# Altium project senior_design_v3.PrjPCB
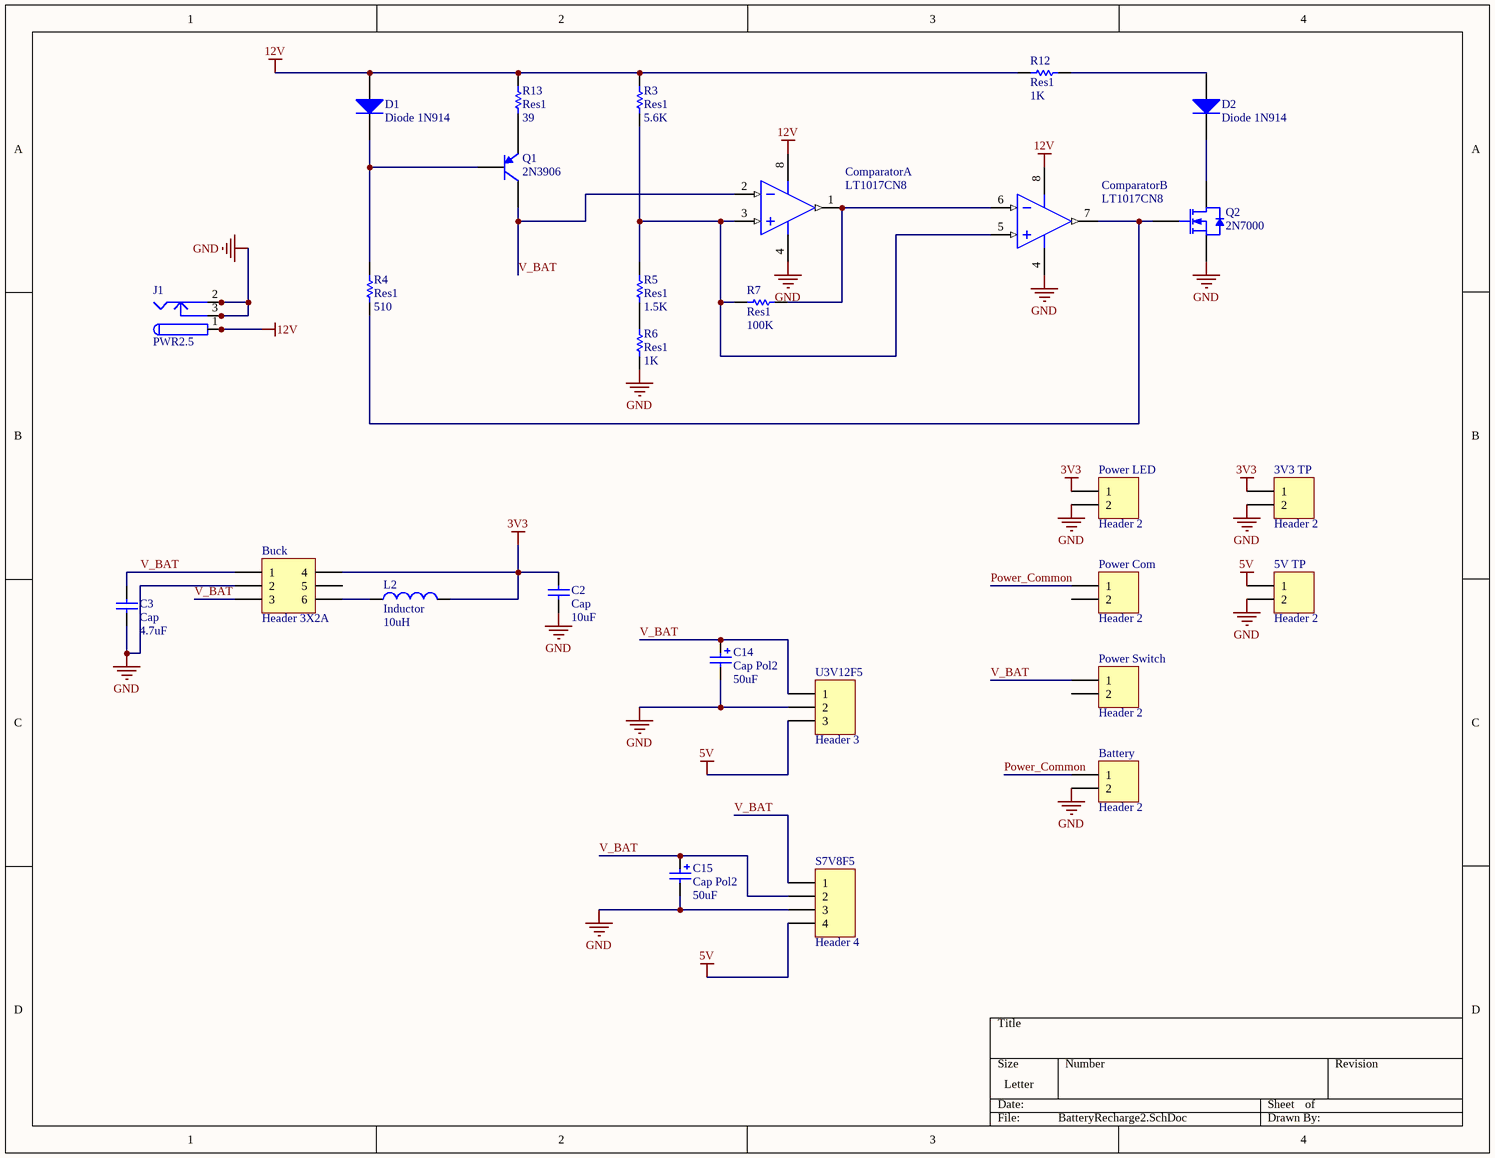
[diagram p0: BatteryRecharge2.SchDoc]
5 sheets, 81 parts. Net scope: global (net labels, ports and power ports of the same name join across sheets).
Board file: main_pcb_v0.PcbDoc
Sheets:
  BatteryRecharge2.SchDoc
  dac_audio_out.SchDoc
  fpga_sram.SchDoc
  lcd_breakout.SchDoc
  MSPBreakout.SchDoc

## Sheet BatteryRecharge2.SchDoc
size Letter

### Parts
(Parts that share a designator on the sheet are numbered #1, #2 ... from top to bottom, then left to right.)
3V3_TP  Header 2  [HDR1X2]
5V_TP  Header 2  [HDR1X2]
Battery  Header 2  [HDR1X2]
Buck  Header 3X2A  [SOT23-6_M]
C2#1  Cap  value 10uF  [6-0805_M]
C3#1  Cap  value 4.7uF  [6-0805_M]
C14  Cap Pol2  value 50uF  [AXIAL-0.3]
C15  Cap Pol2  value 50uF  [AXIAL-0.3]
Comparator  LT1017CN8  [LT-N8]  (parts A,B of 2)
D1  Diode 1N914  [DO-35]
D2  Diode 1N914  [DO-35]
J1  PWR2.5  [KLD-0202]
L2  Inductor  value 10uH  [AXIAL-0.3]
Power_Com  Header 2  [HDR1X2]
Power_LED  Header 2  [HDR1X2]
Power_Switch  Header 2  [HDR1X2]
Q1  2N3906  [TO-92A]
Q2  2N7000  [SOT54]
R3  Res1  value 5.6K  [6-0805_M]
R4  Res1  value 510  [6-0805_M]
R5  Res1  value 1.5K  [6-0805_M]
R6  Res1  value 1K  [6-0805_M]
R7  Res1  value 100K  [6-0805_M]
R12  Res1  value 1K  [6-0805_M]
R13  Res1  value 39  [6-0805_M]
S7V8F5  Header 4  [HDR1X4]
U3V12F5  Header 3  [HDR1X3]

### Nets
3V3: 3V3_TP.1 Buck.4 C2#1.2 L2.2 Power_LED.1
5V: 5V_TP.1 S7V8F5.4 U3V12F5.3
12V: Comparator.8(V+) D1.1(A) J1.1 J1.1A J1.1B R3.2 R12.1 R13.2
GND: 3V3_TP.2 5V_TP.2 Battery.2 Buck.2 C2#1.1 C3#1.1 C14.2 C15.2 Comparator.4(V-) J1.2 J1.2A J1.2B J1.3 J1.3A J1.3B Power_LED.2 Q2.3(S) R6.1 S7V8F5.3 U3V12F5.2
Power_Common: Battery.1 Power_Com.1
V_BAT: Buck.1 Buck.3 C3#1.2 C14.1 C15.1 Comparator.2(-INA) Power_Switch.1 Q1.3(C) S7V8F5.1 S7V8F5.2 U3V12F5.1
NetBuck_6: Buck.6 L2.1
NetComparator_1: Comparator.1(OUTPUTA) Comparator.6(-INB) R7.2
NetComparator_3: Comparator.3(+INA) Comparator.5(+INB) R3.1 R5.2 R7.1
NetComparator_7: Comparator.7(OUTPUTB) Q2.2(G) R4.1
NetD1_2: D1.2(K) Q1.2(B) R4.2
NetD2_1: D2.1(A) R12.2
NetD2_2: D2.2(K) Q2.1(D)
NetQ1_1: Q1.1(E) R13.1
NetR5_1: R5.1 R6.2

Not connected (* = marked no-connect by the designer): Buck 5; Power_Com 2; Power_Switch 2

### Library data of the parts
3V3_TP 5V_TP Battery Power_Com Power_LED Power_Switch = Header 2: Header, 2-Pin; LatestRevisionDate: 17-Jul-2002; LatestRevisionNote: Re-released for DXP Platform.; Publisher: Altium Limited
Buck = Header 3X2A: Header, 3-Pin, Dual row; LatestRevisionDate: 17-Jul-2002; LatestRevisionNote: Re-released for DXP Platform.; Publisher: Altium Limited
C2#1 C3#1 = Cap: Capacitor; Published: 8-Jun-2000; LatestRevisionDate: 17-Jul-2002; LatestRevisionNote: Re-released for DXP Platform.; PackageReference: RAD-0.3; Publisher: Altium Limited; PackageDescription: Radial Cap, Thru-Hole; 2 Leads; 0.3 in Pin Spacing
C14 C15 = Cap Pol2: Polarized Capacitor (Axial); Published: 8-Jun-2000; LatestRevisionDate: 17-Jul-2002; LatestRevisionNote: Re-released for DXP Platform.; PackageReference: POLAR0.8; Publisher: Altium Limited; PackageDescription: Polarized Capacitor; 2 Leads
Comparator = LT1017CN8: Micropower Comparator, 2 Channels, 1.2 to 40 V, 0 to +70 degC, 8-pin PDIP (N8); Generic Part Number: LT1017; Manufacturer: Linear Technology; Channels (#): 2; Prop Delay (us): 22; Supply Current (uA) Guaranteed: 60; Supply Current (uA) Typical: 30; Vos (mV) Guaranteed: 1; Vos (mV) Typical: 0.4; Vs Max (V): 40; Vs Min (V): 1.2; DatasheetVersion: Rev F; PackageReference: N8; PackageDescription: 8-Pin PDIP, Row Spacing 7.62, Pitch 2.54 mm; Supplier 1: Digi-Key; Supplier Part Number 1: LT1017CN8-ND; Supplier 2: Newark; Supplier Part Number 2: 57M0864; Features: Comparator; RoHS: N; Supply Voltage Range: 1.2 to 40 V; Mounting Technology: Through Hole; PartNumber: LT1017CN8; ComponentLink1Description: Manufacturer URL; ComponentLink1URL: http://www.linear.com/; ComponentLink2Description: Datasheet; ComponentLink2URL: http://cds.linear.com/docs/en/datasheet/10178ff.pdf; ComponentLink3Description: Package Specification; ComponentLink3URL: http://cds.linear.com/docs/en/packaging/05081510_I_N8.pdf
D1 D2 = Diode 1N914: High Conductance Fast Diode; Published: 8-Jun-2000; LatestRevisionDate: 17-Jul-2002; LatestRevisionNote: Re-released for DXP Platform.; DatasheetVersion: 1997; PackageReference: DO-35; Publisher: Altium Limited; PackageDescription: Diode, Axial; Body 3.8 x 1.9 mm (LxDia. max), Lead Dia. 0.53 mm (max); Code_JEDEC: DO-204-AH; ComponentLink1Description: Manufacturer Link; ComponentLink1URL: http://www.fairchildsemi.com/; ComponentLink2Description: Datasheet; ComponentLink2URL: http://www.fairchildsemi.com/ds/1N%2F1N4448.pdf
J1 = PWR2.5: Low Voltage Power Supply Connector; Published: 17-Dec-2003; DatasheetDocument: 09-May-2002; Publisher: Altium Limited; ComponentLink1Description: Manufacturer Link; ComponentLink1URL: http://domino.kycon.com/internet/Products.html
L2 = Inductor: Code_IEC: 1005; Published: 8-Jun-2000; LatestRevisionDate: 29-May-2009; LatestRevisionNote: IPC-7351 Footprint Added.; PackageReference: 0402-A; Publisher: Altium Limited; PackageDescription: Chip Inductor; Code_JEITA: 0402
Q1 = 2N3906: PNP General Purpose Amplifier; Published: 8-Jun-2000; LatestRevisionDate: 15-Jan-2003; LatestRevisionNote: PCB Footprint 'BCY-W3/D4.7' replaced; DatasheetVersion: 1997; PackageVersion: Sep-1998; PackageReference: TO-92A; Publisher: Altium Limited; PackageDescription: TO, Flat Index; 3 In-Line, Axial Leads; Body Dia. 4.5mm; Leads 0.51 x 0.48 mm (max); ComponentLink1Description: Manufacturer Link; ComponentLink1URL: http://www.fairchildsemi.com/; ComponentLink2Description: Datasheet; ComponentLink2URL: http://www.fairchildsemi.com/ds/2N%2F2N3906.pdf
Q2 = 2N7000: N-channel Enhancement Mode Field-effect Transistor; Published: 17-Sep-2003; LatestRevisionDate: 12-Dec-2006; LatestRevisionNote: Footprint pad sequence fixed.; DatasheetVersion: 19-May-2000; PackageVersion: Feb-1997; PackageReference: SOT54; Publisher: Altium Limited; PackageDescription: Plastic Single-Ended Leaded (through hole) package; 3 Leads (TO-92); Code_JEITA: SC-43; Code_JEDEC: TO-92; ComponentLink1Description: Manufacturer Link; ComponentLink1URL: http://www.semiconductors.philips.com/; ComponentLink2Description: Datasheet; ComponentLink2URL: http://www.semiconductors.philips.com/acrobat/datasheets/2N7000-03.pdf
R3-R7 R12 R13 = Res1: Resistor; Published: 8-Jun-2000; LatestRevisionDate: 17-Jul-2002; LatestRevisionNote: Re-released for DXP Platform.; PackageReference: AXIAL-0.3; Publisher: Altium Limited; PackageDescription: Axial Device, Thru-Hole; 2 Leads; 0.3 in Pin Spacing
S7V8F5 = Header 4: Header, 4-Pin; LatestRevisionDate: 17-Jul-2002; LatestRevisionNote: Re-released for DXP Platform.; Publisher: Altium Limited
U3V12F5 = Header 3: Header, 3-Pin; LatestRevisionDate: 17-Jul-2002; LatestRevisionNote: Re-released for DXP Platform.; Publisher: Altium Limited

## Sheet dac_audio_out.SchDoc
size A
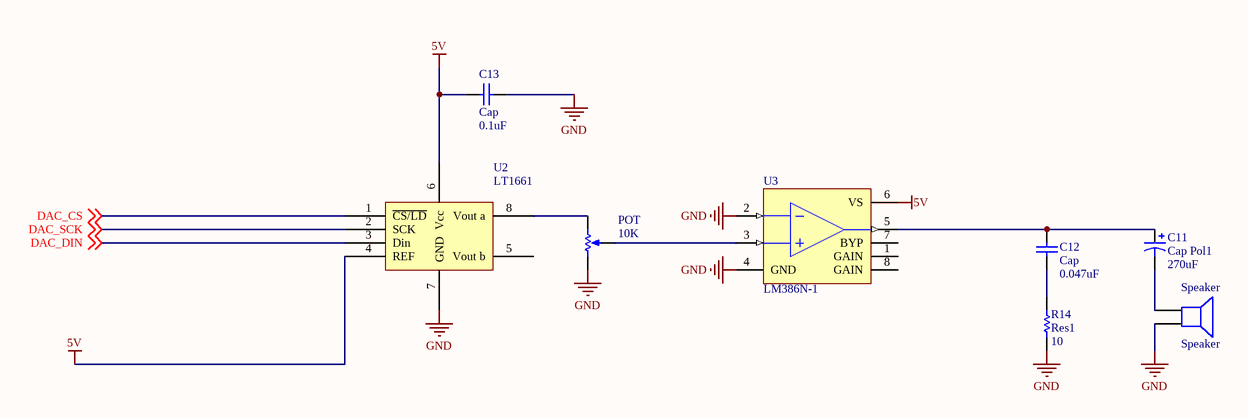
[diagram p1: dac_audio_out.SchDoc]

### Parts
C11  Cap Pol1  value 270uF  [AXIAL-0.3]
C12  Cap  value 0.047uF  [6-0805_M]
C13  Cap  value 0.1uF  [6-0805_M]
POT  value 10K  [VR5]  (hidden comment: RPot_3)
R14  Res1  value 10  [6-0805_M]
Speaker  Speaker  [PIN2]
U2  LT1661  [DIP-8]
U3  LM386N-1  [DIP-8]

### Nets
5V: C13.1 U2.4(REF) U2.6(Vcc) U3.6(VS)
GND: C13.2 POT.1(TOP) R14.1 Speaker.2 U2.7(GND) U3.2(IN-) U3.4(GND)
DAC_CS: U2.1(~{CS/LD}) ; off-sheet DAC_CS
DAC_DIN: U2.3(Din) ; off-sheet DAC_DIN
DAC_SCK: U2.2(SCK) ; off-sheet DAC_SCK
NetC11_1: C11.1 C12.2 U3.5(OUT)
NetC11_2: C11.2 Speaker.1
NetC12_1: C12.1 R14.2
NetPOT_2: POT.2(TAP) U3.3(IN+)
NetPOT_3: POT.3(BOT) U2.8(Vout_a)

Not connected (* = marked no-connect by the designer): U2 5(Vout_b); U3 1(GAIN) 7(BYP) 8(GAIN)

### Library data of the parts
C11 = Cap Pol1: Polarized Capacitor (Radial); Published: 8-Jun-2000; LatestRevisionDate: 17-Jul-2002; LatestRevisionNote: Re-released for DXP Platform.; PackageReference: RB7.6-15; Publisher: Altium Limited; PackageDescription: Polarized Capacitor (Radial); 2 Leads
C12 C13 = Cap: Capacitor; Published: 8-Jun-2000; LatestRevisionDate: 17-Jul-2002; LatestRevisionNote: Re-released for DXP Platform.; PackageReference: RAD-0.3; Publisher: Altium Limited; PackageDescription: Radial Cap, Thru-Hole; 2 Leads; 0.3 in Pin Spacing
POT = RPot: Potentiometer; Sim Note: Enter the Resistance value and the set point into parameter fields.; Set Position: 0.5; Published: 8-Jun-2000; LatestRevisionDate: 17-Jul-2002; LatestRevisionNote: Re-released for DXP Platform.; Publisher: Altium Limited
R14 = Res1: Resistor; Published: 8-Jun-2000; LatestRevisionDate: 17-Jul-2002; LatestRevisionNote: Re-released for DXP Platform.; PackageReference: AXIAL-0.3; Publisher: Altium Limited; PackageDescription: Axial Device, Thru-Hole; 2 Leads; 0.3 in Pin Spacing
Speaker = Speaker: Loudspeaker; Published: 24-Mar-1999; LatestRevisionDate: 17-Jul-2002; LatestRevisionNote: Re-released for DXP Platform.; PackageReference: PIN2; Publisher: Altium Limited
U3 = LM386N-1: Low-Voltage Audio Power Amplifier; Published: 15-Apr-2002; DatasheetDocument: Sep-1997; PackageDocument: Sep-1997; PackageReference: N08E; Publisher: Altium Limited

## Sheet fpga_sram.SchDoc
size A
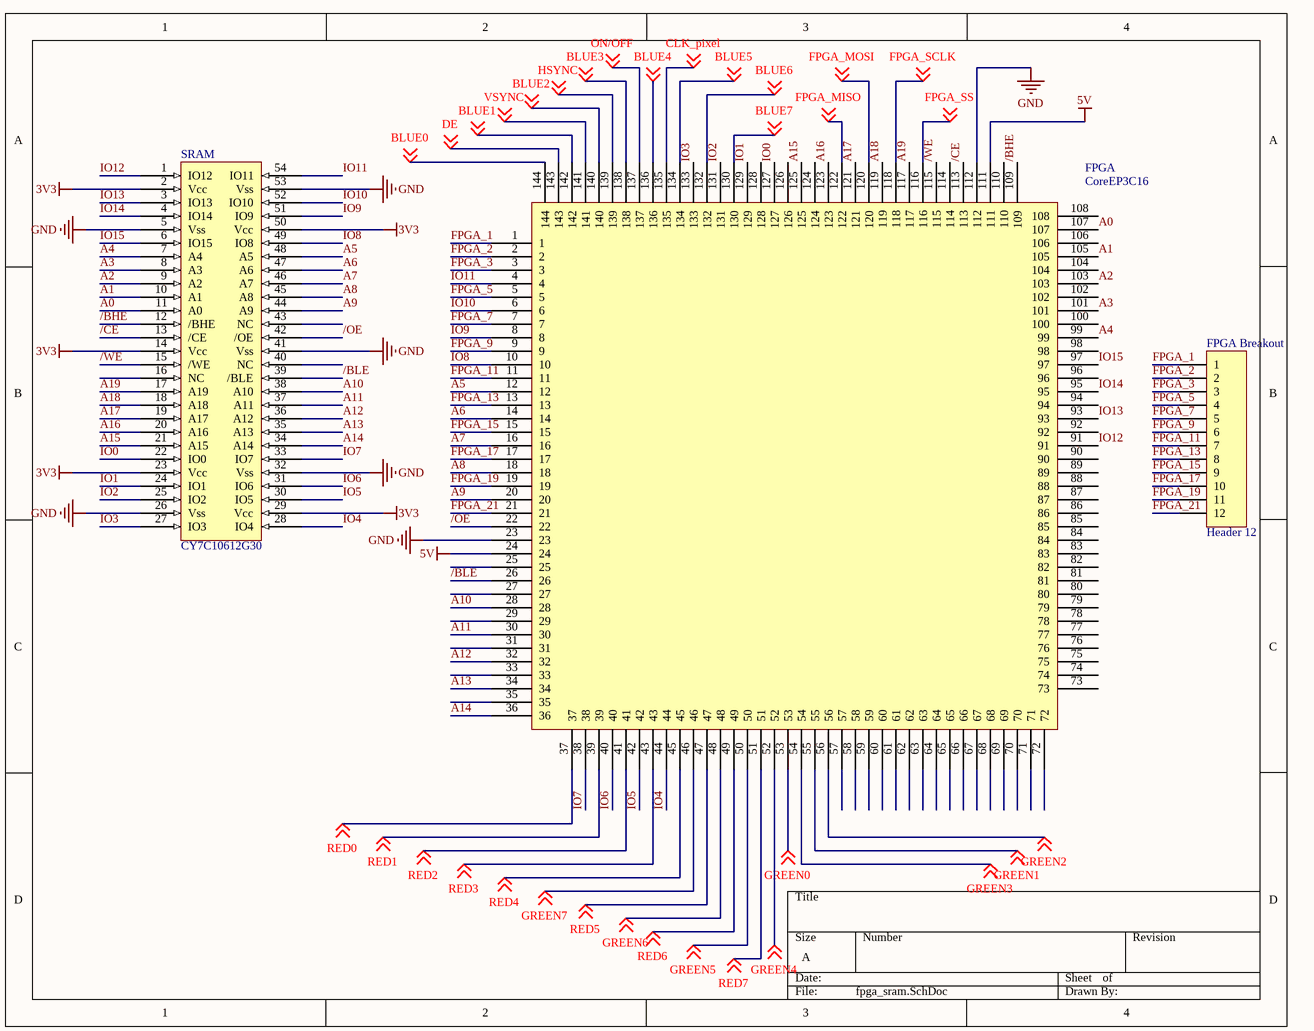
[diagram p2: fpga_sram.SchDoc]

### Parts
FPGA  CoreEP3C16  [CoreEP3C16]
FPGA_Breakout  Header 12  [HDR1X12]
SRAM  CY7C10612G30  [TSOP54]

### Nets
3V3: SRAM.2(Vcc) SRAM.14(Vcc) SRAM.23(Vcc) SRAM.29(Vcc) SRAM.50(Vcc)
5V: FPGA.24 FPGA.111
GND: FPGA.23 FPGA.112 SRAM.5(Vss) SRAM.26(Vss) SRAM.32(Vss) SRAM.41(Vss) SRAM.53(Vss)
/BHE: FPGA.109 SRAM.12(/BHE)
/BLE: FPGA.26 SRAM.39(/BLE)
/CE: FPGA.113 SRAM.13(/CE)
/OE: FPGA.22 SRAM.42(/OE)
/WE: FPGA.115 SRAM.15(/WE)
A0: FPGA.107 SRAM.11(A0)
A1: FPGA.105 SRAM.10(A1)
A2: FPGA.103 SRAM.9(A2)
A3: FPGA.101 SRAM.8(A3)
A4: FPGA.99 SRAM.7(A4)
A5: FPGA.12 SRAM.48(A5)
A6: FPGA.14 SRAM.47(A6)
A7: FPGA.16 SRAM.46(A7)
A8: FPGA.18 SRAM.45(A8)
A9: FPGA.20 SRAM.44(A9)
A10: FPGA.28 SRAM.38(A10)
A11: FPGA.30 SRAM.37(A11)
A12: FPGA.32 SRAM.36(A12)
A13: FPGA.34 SRAM.35(A13)
A14: FPGA.36 SRAM.34(A14)
A15: FPGA.125 SRAM.21(A15)
A16: FPGA.123 SRAM.20(A16)
A17: FPGA.121 SRAM.19(A17)
A18: FPGA.119 SRAM.18(A18)
A19: FPGA.117 SRAM.17(A19)
BLUE0: FPGA.144 ; off-sheet BLUE0
BLUE1: FPGA.142 ; off-sheet BLUE1
BLUE2: FPGA.140 ; off-sheet BLUE2
BLUE3: FPGA.138 ; off-sheet BLUE3
BLUE4: FPGA.136 ; off-sheet BLUE4
BLUE5: FPGA.134 ; off-sheet BLUE5
BLUE6: FPGA.132 ; off-sheet BLUE6
BLUE7: FPGA.130 ; off-sheet BLUE7
CLK_pixel: FPGA.135 ; off-sheet CLK_pixel
DE: FPGA.143 ; off-sheet DE
FPGA_1: FPGA.1 FPGA_Breakout.1
FPGA_2: FPGA.2 FPGA_Breakout.2
FPGA_3: FPGA.3 FPGA_Breakout.3
FPGA_5: FPGA.5 FPGA_Breakout.4
FPGA_7: FPGA.7 FPGA_Breakout.5
FPGA_9: FPGA.9 FPGA_Breakout.6
FPGA_11: FPGA.11 FPGA_Breakout.7
FPGA_13: FPGA.13 FPGA_Breakout.8
FPGA_15: FPGA.15 FPGA_Breakout.9
FPGA_17: FPGA.17 FPGA_Breakout.10
FPGA_19: FPGA.19 FPGA_Breakout.11
FPGA_21: FPGA.21 FPGA_Breakout.12
FPGA_MISO: FPGA.122 ; off-sheet FPGA_MISO
FPGA_MOSI: FPGA.120 ; off-sheet FPGA_MOSI
FPGA_SCLK: FPGA.118 ; off-sheet FPGA_SCLK
FPGA_SS: FPGA.116 ; off-sheet FPGA_SS
GREEN0: FPGA.53 ; off-sheet GREEN0
GREEN1: FPGA.55 ; off-sheet GREEN1
GREEN2: FPGA.56 ; off-sheet GREEN2
GREEN3: FPGA.54 ; off-sheet GREEN3
GREEN4: FPGA.52 ; off-sheet GREEN4
GREEN5: FPGA.50 ; off-sheet GREEN5
GREEN6: FPGA.48 ; off-sheet GREEN6
GREEN7: FPGA.46 ; off-sheet GREEN7
HSYNC: FPGA.139 ; off-sheet HSYNC
IO0: FPGA.127 SRAM.22(IO0)
IO1: FPGA.129 SRAM.24(IO1)
IO2: FPGA.131 SRAM.25(IO2)
IO3: FPGA.133 SRAM.27(IO3)
IO4: FPGA.44 SRAM.28(IO4)
IO5: FPGA.42 SRAM.30(IO5)
IO6: FPGA.40 SRAM.31(IO6)
IO7: FPGA.38 SRAM.33(IO7)
IO8: FPGA.10 SRAM.49(IO8)
IO9: FPGA.8 SRAM.51(IO9)
IO10: FPGA.6 SRAM.52(IO10)
IO11: FPGA.4 SRAM.54(IO11)
IO12: FPGA.91 SRAM.1(IO12)
IO13: FPGA.93 SRAM.3(IO13)
IO14: FPGA.95 SRAM.4(IO14)
IO15: FPGA.97 SRAM.6(IO15)
ON/OFF: FPGA.137 ; off-sheet ON/OFF
RED0: FPGA.37 ; off-sheet RED0
RED1: FPGA.39 ; off-sheet RED1
RED2: FPGA.41 ; off-sheet RED2
RED3: FPGA.43 ; off-sheet RED3
RED4: FPGA.45 ; off-sheet RED4
RED5: FPGA.47 ; off-sheet RED5
RED6: FPGA.49 ; off-sheet RED6
RED7: FPGA.51 ; off-sheet RED7
VSYNC: FPGA.141 ; off-sheet VSYNC

Not connected (* = marked no-connect by the designer): FPGA 25 27 29 31 33 35 57 58 59 60 61 62 63 64 65 66 67 68 69 70 71 72 73 74 75 76 77 78 79 80 81 82 83 84 85 86 87 88 89 90 92 94 96 98 100 102 104 106 108 110 114 124 126 128; SRAM 16(NC) 40(NC) 43(NC)

### Library data of the parts
FPGA_Breakout = Header 12: Header, 12-Pin; LatestRevisionDate: 17-Jul-2002; LatestRevisionNote: Re-released for DXP Platform.; Publisher: Altium Limited

## Sheet lcd_breakout.SchDoc
size A
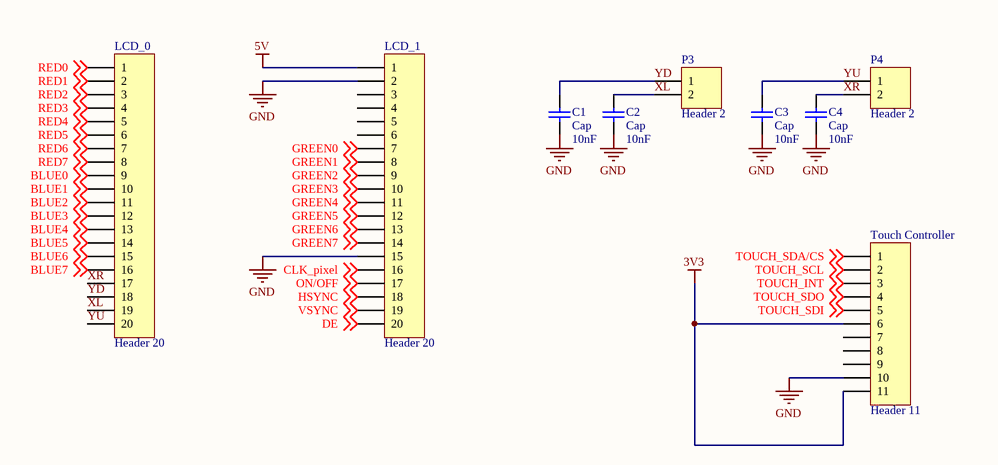
[diagram p3: lcd_breakout.SchDoc]

### Parts
(Parts that share a designator on the sheet are numbered #1, #2 ... from top to bottom, then left to right.)
C1  Cap  value 10nF  [6-0805_M]
C2#2  Cap  value 10nF  [6-0805_M]
C3#2  Cap  value 10nF  [6-0805_M]
C4#1  Cap  value 10nF  [6-0805_M]
LCD_0  Header 20  [HDR1X20]
LCD_1  Header 20  [HDR1X20]
P3  Header 2  [HDR1X2]
P4  Header 2  [HDR1X2]
Touch_Controller  Header 11  [HDR1X11]

### Nets
3V3: Touch_Controller.6 Touch_Controller.11
5V: LCD_1.1
GND: C1.1 C2#2.1 C3#2.1 C4#1.1 LCD_1.2 LCD_1.15 Touch_Controller.10
BLUE0: LCD_0.9 ; off-sheet BLUE0
BLUE1: LCD_0.10 ; off-sheet BLUE1
BLUE2: LCD_0.11 ; off-sheet BLUE2
BLUE3: LCD_0.12 ; off-sheet BLUE3
BLUE4: LCD_0.13 ; off-sheet BLUE4
BLUE5: LCD_0.14 ; off-sheet BLUE5
BLUE6: LCD_0.15 ; off-sheet BLUE6
BLUE7: LCD_0.16 ; off-sheet BLUE7
CLK_pixel: LCD_1.16 ; off-sheet CLK_pixel
DE: LCD_1.20 ; off-sheet DE
GREEN0: LCD_1.7 ; off-sheet GREEN0
GREEN1: LCD_1.8 ; off-sheet GREEN1
GREEN2: LCD_1.9 ; off-sheet GREEN2
GREEN3: LCD_1.10 ; off-sheet GREEN3
GREEN4: LCD_1.11 ; off-sheet GREEN4
GREEN5: LCD_1.12 ; off-sheet GREEN5
GREEN6: LCD_1.13 ; off-sheet GREEN6
GREEN7: LCD_1.14 ; off-sheet GREEN7
HSYNC: LCD_1.18 ; off-sheet HSYNC
ON/OFF: LCD_1.17 ; off-sheet ON/OFF
RED0: LCD_0.1 ; off-sheet RED0
RED1: LCD_0.2 ; off-sheet RED1
RED2: LCD_0.3 ; off-sheet RED2
RED3: LCD_0.4 ; off-sheet RED3
RED4: LCD_0.5 ; off-sheet RED4
RED5: LCD_0.6 ; off-sheet RED5
RED6: LCD_0.7 ; off-sheet RED6
RED7: LCD_0.8 ; off-sheet RED7
TOUCH_INT: Touch_Controller.3 ; off-sheet TOUCH_INT
TOUCH_SCL: Touch_Controller.2 ; off-sheet TOUCH_SCL
TOUCH_SDA/CS: Touch_Controller.1 ; off-sheet TOUCH_SDA/CS
TOUCH_SDI: Touch_Controller.5 ; off-sheet TOUCH_SDI
TOUCH_SDO: Touch_Controller.4 ; off-sheet TOUCH_SDO
VSYNC: LCD_1.19 ; off-sheet VSYNC
XL: C2#2.2 LCD_0.19 P3.2
XR: C4#1.2 LCD_0.17 P4.2
YD: C1.2 LCD_0.18 P3.1
YU: C3#2.2 LCD_0.20 P4.1

Not connected (* = marked no-connect by the designer): LCD_1 3 4 5 6; Touch_Controller 7 8 9

### Library data of the parts
C1 C2#2 C3#2 C4#1 = Cap: Capacitor; Published: 8-Jun-2000; LatestRevisionDate: 17-Jul-2002; LatestRevisionNote: Re-released for DXP Platform.; PackageReference: RAD-0.3; Publisher: Altium Limited; PackageDescription: Radial Cap, Thru-Hole; 2 Leads; 0.3 in Pin Spacing
LCD_0 LCD_1 = Header 20: Header, 20-Pin; LatestRevisionDate: 17-Jul-2002; LatestRevisionNote: Re-released for DXP Platform.; Publisher: Altium Limited
P3 P4 = Header 2: Header, 2-Pin; LatestRevisionDate: 17-Jul-2002; LatestRevisionNote: Re-released for DXP Platform.; Publisher: Altium Limited
Touch_Controller = Header 11: Header, 11-Pin; LatestRevisionDate: 17-Jul-2002; LatestRevisionNote: Re-released for DXP Platform.; Publisher: Altium Limited

## Sheet MSPBreakout.SchDoc
size Letter
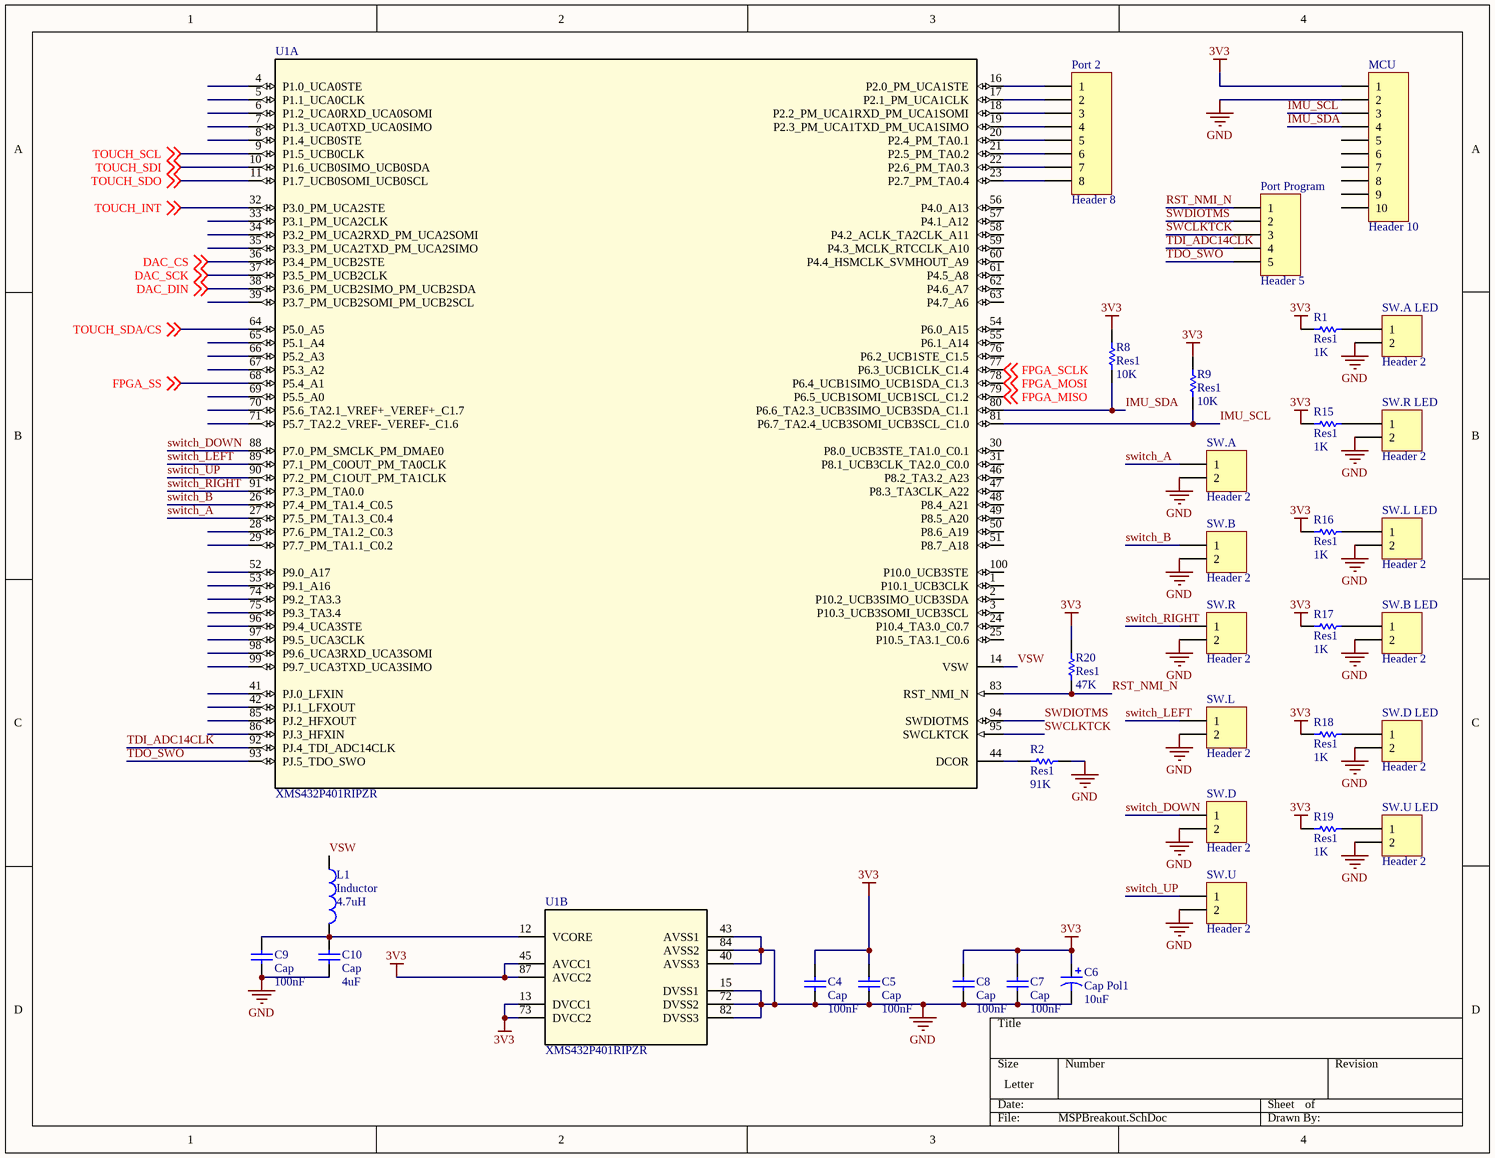
[diagram p4: MSPBreakout.SchDoc]

### Parts
(Parts that share a designator on the sheet are numbered #1, #2 ... from top to bottom, then left to right.)
C4#2  Cap  value 100nF  [6-0805_M]
C5  Cap  value 100nF  [6-0805_M]
C6  Cap Pol1  value 10uF  [6-0805_M]
C7  Cap  value 100nF  [6-0805_M]
C8  Cap  value 100nF  [6-0805_M]
C9  Cap  value 100nF  [6-0805_M]
C10  Cap  value 4uF  [6-0805_M]
L1  Inductor  value 4.7uH  [AXIAL-0.3]
MCU  Header 10  [HDR1X10]
Port_2  Header 8  [HDR1X8]
Port_Program  Header 5  [HDR1X5]
R1  Res1  value 1K  [6-0805_M]
R2  Res1  value 91K  [6-0805_M]
R8  Res1  value 10K  [6-0805_M]
R9  Res1  value 10K  [6-0805_M]
R15  Res1  value 1K  [6-0805_M]
R16  Res1  value 1K  [6-0805_M]
R17  Res1  value 1K  [6-0805_M]
R18  Res1  value 1K  [6-0805_M]
R19  Res1  value 1K  [6-0805_M]
R20  Res1  value 47K  [6-0805_M]
SW.A  Header 2  [HDR1X2]
SW.A_LED  Header 2  [HDR1X2]
SW.B  Header 2  [HDR1X2]
SW.B_LED  Header 2  [HDR1X2]
SW.D  Header 2  [HDR1X2]
SW.D_LED  Header 2  [HDR1X2]
SW.L  Header 2  [HDR1X2]
SW.L_LED  Header 2  [HDR1X2]
SW.R  Header 2  [HDR1X2]
SW.R_LED  Header 2  [HDR1X2]
SW.U  Header 2  [HDR1X2]
SW.U_LED  Header 2  [HDR1X2]
U1  XMS432P401RIPZR  [PZ0100A_M]  (parts A,B of 2)

### Nets
3V3: C4#2.2 C5.2 C6.1 C7.2 C8.2 MCU.1 R1.1 R8.2 R9.2 R15.1 R16.1 R17.1 R18.1 R19.1 R20.2 U1.13(DVCC1) U1.45(AVCC1) U1.73(DVCC2) U1.87(AVCC2)
GND: C4#2.1 C5.1 C6.2 C7.1 C8.1 C9.1 C10.1 MCU.2 R2.2 SW.A.2 SW.A_LED.2 SW.B.2 SW.B_LED.2 SW.D.2 SW.D_LED.2 SW.L.2 SW.L_LED.2 SW.R.2 SW.R_LED.2 SW.U.2 SW.U_LED.2 U1.15(DVSS1) U1.40(AVSS3) U1.43(AVSS1) U1.72(DVSS2) U1.82(DVSS3) U1.84(AVSS2)
DAC_CS: U1.36(P3.4_PM_UCB2STE) ; off-sheet DAC_CS
DAC_DIN: U1.38(P3.6_PM_UCB2SIMO_PM_UCB2SDA) ; off-sheet DAC_DIN
DAC_SCK: U1.37(P3.5_PM_UCB2CLK) ; off-sheet DAC_SCK
FPGA_MISO: U1.79(P6.5_UCB1SOMI_UCB1SCL_C1.2) ; off-sheet FPGA_MISO
FPGA_MOSI: U1.78(P6.4_UCB1SIMO_UCB1SDA_C1.3) ; off-sheet FPGA_MOSI
FPGA_SCLK: U1.77(P6.3_UCB1CLK_C1.4) ; off-sheet FPGA_SCLK
FPGA_SS: U1.68(P5.4_A1) ; off-sheet FPGA_SS
IMU_SCL: MCU.3 R9.1 U1.81(P6.7_TA2.4_UCB3SOMI_UCB3SCL_C1.0)
IMU_SDA: MCU.4 R8.1 U1.80(P6.6_TA2.3_UCB3SIMO_UCB3SDA_C1.1)
RST_NMI_N: Port_Program.1 R20.1 U1.83(RST_NMI_N)
SWCLKTCK: Port_Program.3 U1.95(SWCLKTCK)
SWDIOTMS: Port_Program.2 U1.94(SWDIOTMS)
switch_A: SW.A.1 U1.27(P7.5_PM_TA1.3_C0.4)
switch_B: SW.B.1 U1.26(P7.4_PM_TA1.4_C0.5)
switch_DOWN: SW.D.1 U1.88(P7.0_PM_SMCLK_PM_DMAE0)
switch_LEFT: SW.L.1 U1.89(P7.1_PM_C0OUT_PM_TA0CLK)
switch_RIGHT: SW.R.1 U1.91(P7.3_PM_TA0.0)
switch_UP: SW.U.1 U1.90(P7.2_PM_C1OUT_PM_TA1CLK)
TDI_ADC14CLK: Port_Program.4 U1.92(PJ.4_TDI_ADC14CLK)
TDO_SWO: Port_Program.5 U1.93(PJ.5_TDO_SWO)
TOUCH_INT: U1.32(P3.0_PM_UCA2STE) ; off-sheet TOUCH_INT
TOUCH_SCL: U1.9(P1.5_UCB0CLK) ; off-sheet TOUCH_SCL
TOUCH_SDA/CS: U1.64(P5.0_A5) ; off-sheet TOUCH_SDA/CS
TOUCH_SDI: U1.10(P1.6_UCB0SIMO_UCB0SDA) ; off-sheet TOUCH_SDI
TOUCH_SDO: U1.11(P1.7_UCB0SOMI_UCB0SCL) ; off-sheet TOUCH_SDO
VSW: L1.1 U1.14(VSW)
NetC9_2: C9.2 C10.2 L1.2 U1.12(VCORE)
NetPort_2_1: Port_2.1 U1.16(P2.0_PM_UCA1STE)
NetPort_2_2: Port_2.2 U1.17(P2.1_PM_UCA1CLK)
NetPort_2_3: Port_2.3 U1.18(P2.2_PM_UCA1RXD_PM_UCA1SOMI)
NetPort_2_4: Port_2.4 U1.19(P2.3_PM_UCA1TXD_PM_UCA1SIMO)
NetPort_2_5: Port_2.5 U1.20(P2.4_PM_TA0.1)
NetPort_2_6: Port_2.6 U1.21(P2.5_PM_TA0.2)
NetPort_2_7: Port_2.7 U1.22(P2.6_PM_TA0.3)
NetPort_2_8: Port_2.8 U1.23(P2.7_PM_TA0.4)
NetR1_2: R1.2 SW.A_LED.1
NetR2_1: R2.1 U1.44(DCOR)
NetR15_2: R15.2 SW.R_LED.1
NetR16_2: R16.2 SW.L_LED.1
NetR17_2: R17.2 SW.B_LED.1
NetR18_2: R18.2 SW.D_LED.1
NetR19_2: R19.2 SW.U_LED.1

Not connected (* = marked no-connect by the designer): MCU 5 6 7 8 9 10; U1 1(P10.1_UCB3CLK) 2(P10.2_UCB3SIMO_UCB3SDA) 3(P10.3_UCB3SOMI_UCB3SCL) 4(P1.0_UCA0STE) 5(P1.1_UCA0CLK) 6(P1.2_UCA0RXD_UCA0SOMI) 7(P1.3_UCA0TXD_UCA0SIMO) 8(P1.4_UCB0STE) 24(P10.4_TA3.0_C0.7) 25(P10.5_TA3.1_C0.6) 28(P7.6_PM_TA1.2_C0.3) 29(P7.7_PM_TA1.1_C0.2) 30(P8.0_UCB3STE_TA1.0_C0.1) 31(P8.1_UCB3CLK_TA2.0_C0.0) 33(P3.1_PM_UCA2CLK) 34(P3.2_PM_UCA2RXD_PM_UCA2SOMI) 35(P3.3_PM_UCA2TXD_PM_UCA2SIMO) 39(P3.7_PM_UCB2SOMI_PM_UCB2SCL) 41(PJ.0_LFXIN) 42(PJ.1_LFXOUT) 46(P8.2_TA3.2_A23) 47(P8.3_TA3CLK_A22) 48(P8.4_A21) 49(P8.5_A20) 50(P8.6_A19) 51(P8.7_A18) 52(P9.0_A17) 53(P9.1_A16) 54(P6.0_A15) 55(P6.1_A14) 56(P4.0_A13) 57(P4.1_A12) 58(P4.2_ACLK_TA2CLK_A11) 59(P4.3_MCLK_RTCCLK_A10) 60(P4.4_HSMCLK_SVMHOUT_A9) 61(P4.5_A8) 62(P4.6_A7) 63(P4.7_A6) 65(P5.1_A4) 66(P5.2_A3) 67(P5.3_A2) 69(P5.5_A0) 70(P5.6_TA2.1_VREF+_VEREF+_C1.7) 71(P5.7_TA2.2_VREF-_VEREF-_C1.6) 74(P9.2_TA3.3) 75(P9.3_TA3.4) 76(P6.2_UCB1STE_C1.5) 85(PJ.2_HFXOUT) 86(PJ.3_HFXIN) 96(P9.4_UCA3STE) 97(P9.5_UCA3CLK) 98(P9.6_UCA3RXD_UCA3SOMI) 99(P9.7_UCA3TXD_UCA3SIMO) 100(P10.0_UCB3STE)

### Library data of the parts
C4#2 C5 C7-C10 = Cap: Capacitor; Published: 8-Jun-2000; LatestRevisionDate: 17-Jul-2002; LatestRevisionNote: Re-released for DXP Platform.; PackageReference: RAD-0.3; Publisher: Altium Limited; PackageDescription: Radial Cap, Thru-Hole; 2 Leads; 0.3 in Pin Spacing
C6 = Cap Pol1: Polarized Capacitor (Radial); Published: 8-Jun-2000; LatestRevisionDate: 17-Jul-2002; LatestRevisionNote: Re-released for DXP Platform.; PackageReference: RB7.6-15; Publisher: Altium Limited; PackageDescription: Polarized Capacitor (Radial); 2 Leads
L1 = Inductor: Code_IEC: 1005; Published: 8-Jun-2000; LatestRevisionDate: 29-May-2009; LatestRevisionNote: IPC-7351 Footprint Added.; PackageReference: 0402-A; Publisher: Altium Limited; PackageDescription: Chip Inductor; Code_JEITA: 0402
MCU = Header 10: Header, 10-Pin; LatestRevisionDate: 17-Jul-2002; LatestRevisionNote: Re-released for DXP Platform.; Publisher: Altium Limited
Port_2 = Header 8: Header, 8-Pin; LatestRevisionDate: 17-Jul-2002; LatestRevisionNote: Re-released for DXP Platform.; Publisher: Altium Limited
Port_Program = Header 5: Header, 5-Pin; LatestRevisionDate: 17-Jul-2002; LatestRevisionNote: Re-released for DXP Platform.; Publisher: Altium Limited
R1 R2 R8 R9 R15-R20 = Res1: Resistor; Published: 8-Jun-2000; LatestRevisionDate: 17-Jul-2002; LatestRevisionNote: Re-released for DXP Platform.; PackageReference: AXIAL-0.3; Publisher: Altium Limited; PackageDescription: Axial Device, Thru-Hole; 2 Leads; 0.3 in Pin Spacing
SW.A SW.A_LED SW.B SW.B_LED SW.D SW.D_LED SW.L SW.L_LED SW.R SW.R_LED SW.U SW.U_LED = Header 2: Header, 2-Pin; LatestRevisionDate: 17-Jul-2002; LatestRevisionNote: Re-released for DXP Platform.; Publisher: Altium Limited
U1 = XMS432P401RIPZR: Imported; Manufacturer: Texas Instruments; CompType: IC; PIN_COUNT: 100; PartNumber: XMS432P401RIPZR; PackageReference: PZ0100A; MountType: SMT; RefDes: RefDes; TYPE: TYPE; Value: Value

## Nets that join several sheets
3V3: BatteryRecharge2 (5 pins), fpga_sram (5 pins), lcd_breakout (Touch_Controller.6 Touch_Controller.11), MSPBreakout (19 pins)
5V: BatteryRecharge2 (5V_TP.1 S7V8F5.4 U3V12F5.3), dac_audio_out (C13.1 U2.4 U2.6 U3.6), fpga_sram (FPGA.24 FPGA.111), lcd_breakout (LCD_1.1)
GND: BatteryRecharge2 (20 pins), dac_audio_out (7 pins), fpga_sram (7 pins), lcd_breakout (7 pins), MSPBreakout (27 pins)
BLUE0: fpga_sram (FPGA.144), lcd_breakout (LCD_0.9)
BLUE1: fpga_sram (FPGA.142), lcd_breakout (LCD_0.10)
BLUE2: fpga_sram (FPGA.140), lcd_breakout (LCD_0.11)
BLUE3: fpga_sram (FPGA.138), lcd_breakout (LCD_0.12)
BLUE4: fpga_sram (FPGA.136), lcd_breakout (LCD_0.13)
BLUE5: fpga_sram (FPGA.134), lcd_breakout (LCD_0.14)
BLUE6: fpga_sram (FPGA.132), lcd_breakout (LCD_0.15)
BLUE7: fpga_sram (FPGA.130), lcd_breakout (LCD_0.16)
CLK_pixel: fpga_sram (FPGA.135), lcd_breakout (LCD_1.16)
DAC_CS: dac_audio_out (U2.1), MSPBreakout (U1.36)
DAC_DIN: dac_audio_out (U2.3), MSPBreakout (U1.38)
DAC_SCK: dac_audio_out (U2.2), MSPBreakout (U1.37)
DE: fpga_sram (FPGA.143), lcd_breakout (LCD_1.20)
FPGA_MISO: fpga_sram (FPGA.122), MSPBreakout (U1.79)
FPGA_MOSI: fpga_sram (FPGA.120), MSPBreakout (U1.78)
FPGA_SCLK: fpga_sram (FPGA.118), MSPBreakout (U1.77)
FPGA_SS: fpga_sram (FPGA.116), MSPBreakout (U1.68)
GREEN0: fpga_sram (FPGA.53), lcd_breakout (LCD_1.7)
GREEN1: fpga_sram (FPGA.55), lcd_breakout (LCD_1.8)
GREEN2: fpga_sram (FPGA.56), lcd_breakout (LCD_1.9)
GREEN3: fpga_sram (FPGA.54), lcd_breakout (LCD_1.10)
GREEN4: fpga_sram (FPGA.52), lcd_breakout (LCD_1.11)
GREEN5: fpga_sram (FPGA.50), lcd_breakout (LCD_1.12)
GREEN6: fpga_sram (FPGA.48), lcd_breakout (LCD_1.13)
GREEN7: fpga_sram (FPGA.46), lcd_breakout (LCD_1.14)
HSYNC: fpga_sram (FPGA.139), lcd_breakout (LCD_1.18)
ON/OFF: fpga_sram (FPGA.137), lcd_breakout (LCD_1.17)
RED0: fpga_sram (FPGA.37), lcd_breakout (LCD_0.1)
RED1: fpga_sram (FPGA.39), lcd_breakout (LCD_0.2)
RED2: fpga_sram (FPGA.41), lcd_breakout (LCD_0.3)
RED3: fpga_sram (FPGA.43), lcd_breakout (LCD_0.4)
RED4: fpga_sram (FPGA.45), lcd_breakout (LCD_0.5)
RED5: fpga_sram (FPGA.47), lcd_breakout (LCD_0.6)
RED6: fpga_sram (FPGA.49), lcd_breakout (LCD_0.7)
RED7: fpga_sram (FPGA.51), lcd_breakout (LCD_0.8)
TOUCH_INT: lcd_breakout (Touch_Controller.3), MSPBreakout (U1.32)
TOUCH_SCL: lcd_breakout (Touch_Controller.2), MSPBreakout (U1.9)
TOUCH_SDA/CS: lcd_breakout (Touch_Controller.1), MSPBreakout (U1.64)
TOUCH_SDI: lcd_breakout (Touch_Controller.5), MSPBreakout (U1.10)
TOUCH_SDO: lcd_breakout (Touch_Controller.4), MSPBreakout (U1.11)
VSYNC: fpga_sram (FPGA.141), lcd_breakout (LCD_1.19)